# Altium project RadioProject.PrjPcb (part 1 of 2)
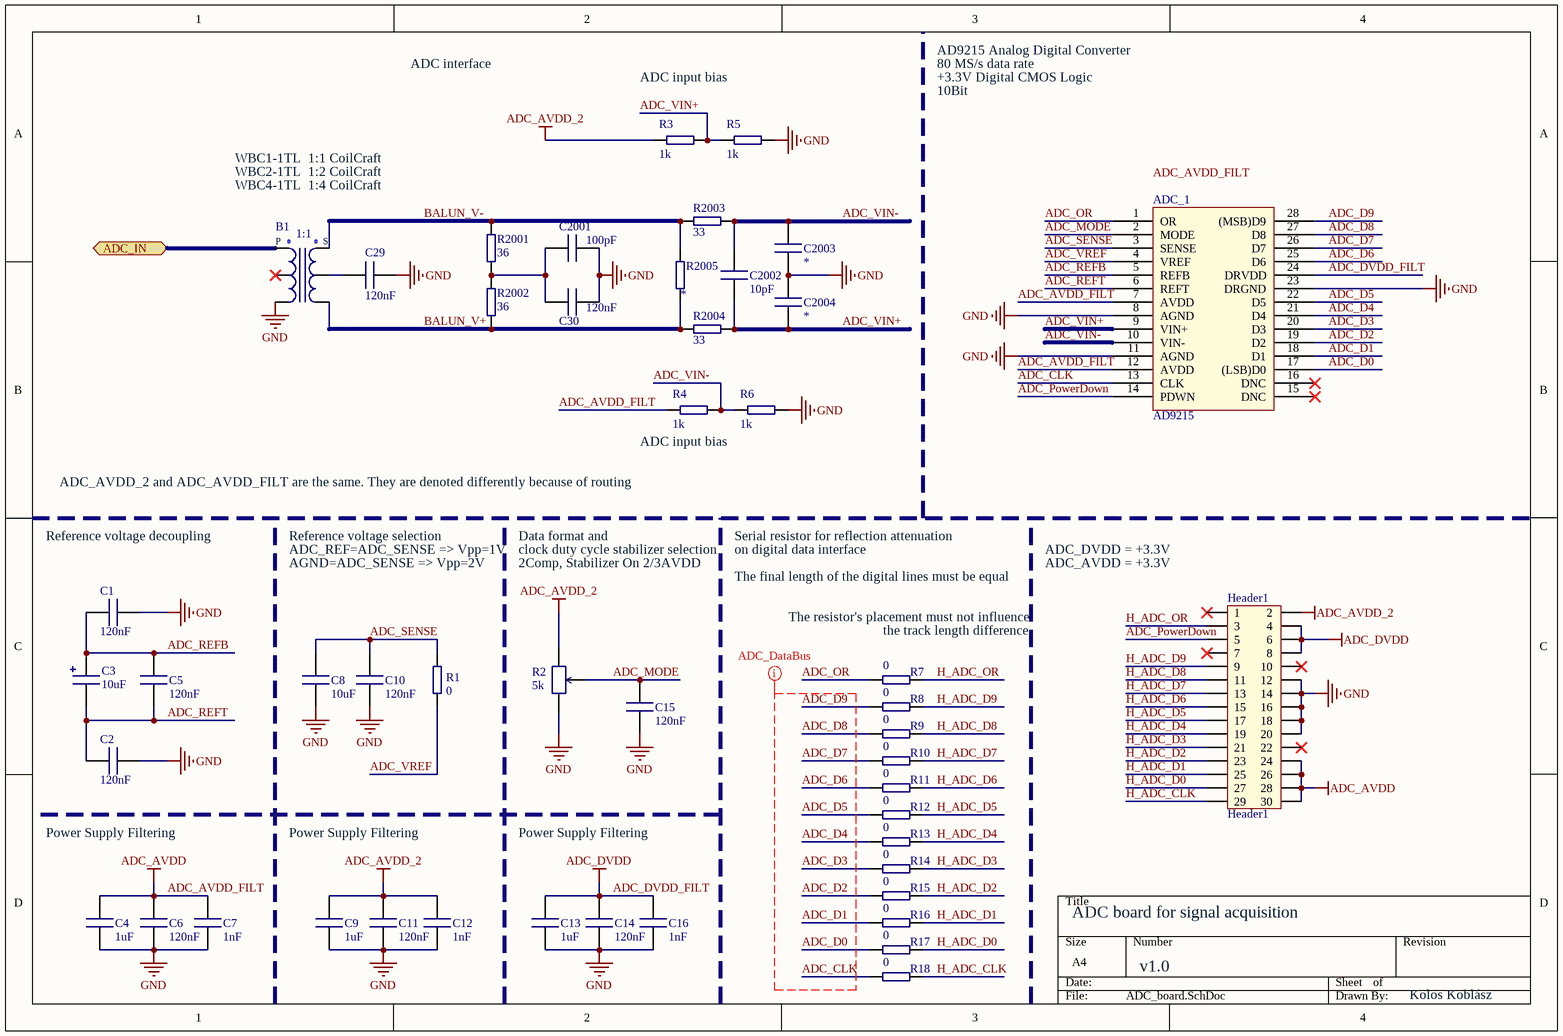
[diagram p0: ADC_board.SchDoc]
9 sheets, 477 parts. Net scope: flat (ports and power ports of the same name join across sheets).
Sheets:
  ADC_board.SchDoc
  DAC_board.SchDoc
  MotherBoard_Interconnect.SchDoc
  ADC_Filter.SchDoc
  DAC_Filter.SchDoc
  MotherBoard_PowerSupply.SchDoc
  Synthesizer.SchDoc
  UpConverter.SchDoc
  DownConverter.SchDoc

## Sheet ADC_board.SchDoc
size A4; DocumentNumber: 1; SheetNumber: 1; SheetTotal: 9

### Parts
ADC_1  AD9215  [AD9215]
B1  ImpedanceTransformation P : S: 1:1  [Balun_Coil_Craft_WBC]  (hidden comment: Balun)
C1  value 120nF  [0805 SMD Passive]  (hidden comment: Cap1)
C2  value 120nF  [0805 SMD Passive]  (hidden comment: Cap1)
C3  value 10uF  [ELKO_CAP]  (hidden comment: Cap2)
C4  value 1uF  [0805 SMD Passive]  (hidden comment: Cap1)
C5  value 120nF  [0805 SMD Passive]  (hidden comment: Cap1)
C6  value 120nF  [0805 SMD Passive]  (hidden comment: Cap1)
C7  value 1nF  [0805 SMD Passive]  (hidden comment: Cap1)
C8  value 10uF  [0805 SMD Passive]  (hidden comment: Cap1)
C9  value 1uF  [0805 SMD Passive]  (hidden comment: Cap1)
C10  value 120nF  [0805 SMD Passive]  (hidden comment: Cap1)
C11  value 120nF  [0805 SMD Passive]  (hidden comment: Cap1)
C12  value 1nF  [0805 SMD Passive]  (hidden comment: Cap1)
C13  value 1uF  [0805 SMD Passive]  (hidden comment: Cap1)
C14  value 120nF  [0805 SMD Passive]  (hidden comment: Cap1)
C15  value 120nF  [0805 SMD Passive]  (hidden comment: Cap1)
C16  value 1nF  [0805 SMD Passive]  (hidden comment: Cap1)
C29  value 120nF  [0805 SMD Passive]  (hidden comment: Cap1)
C30  value 120nF  [0805 SMD Passive]  (hidden comment: Cap1)
C2001  value 100pF  [0805 SMD Passive]  (hidden comment: Cap1)
C2002  value 10pF  [0805 SMD Passive]  (hidden comment: Cap1)
C2003  Cap1  [0805 SMD Passive]  (value not drawn)
C2004  Cap1  [0805 SMD Passive]  (value not drawn)
Header1  Header1  [Header1]
R1  value 0  [0805 SMD Passive]  (hidden comment: Resistor)
R2  value 5k  [TC33-2]  (hidden comment: VariableResistor)
R3  value 1k  [0805 SMD Passive]  (hidden comment: Resistor)
R4  value 1k  [0805 SMD Passive]  (hidden comment: Resistor)
R5  value 1k  [0805 SMD Passive]  (hidden comment: Resistor)
R6  value 1k  [0805 SMD Passive]  (hidden comment: Resistor)
R7  value 0  [0805 SMD Passive]  (hidden comment: Resistor)
R8  value 0  [0805 SMD Passive]  (hidden comment: Resistor)
R9  value 0  [0805 SMD Passive]  (hidden comment: Resistor)
R10  value 0  [0805 SMD Passive]  (hidden comment: Resistor)
R11  value 0  [0805 SMD Passive]  (hidden comment: Resistor)
R12  value 0  [0805 SMD Passive]  (hidden comment: Resistor)
R13  value 0  [0805 SMD Passive]  (hidden comment: Resistor)
R14  value 0  [0805 SMD Passive]  (hidden comment: Resistor)
R15  value 0  [0805 SMD Passive]  (hidden comment: Resistor)
R16  value 0  [0805 SMD Passive]  (hidden comment: Resistor)
R17  value 0  [0805 SMD Passive]  (hidden comment: Resistor)
R18  value 0  [0805 SMD Passive]  (hidden comment: Resistor)
R2001  value 36  [0805 SMD Passive]  (hidden comment: Resistor)
R2002  value 36  [0805 SMD Passive]  (hidden comment: Resistor)
R2003  value 33  [0805 SMD Passive]  (hidden comment: Resistor)
R2004  value 33  [0805 SMD Passive]  (hidden comment: Resistor)
R2005  Resistor  [0805 SMD Passive]  (value not drawn)

### Ports
ADC_IN

### Nets
ADC_AVDD_2: C9.1 C11.1 C12.1 Header1.2 R2.1 R3.1
ADC_AVDD_FILT: ADC_1.7(AVDD) ADC_1.12(AVDD) C4.1 C6.1 C7.1 Header1.24 Header1.26 Header1.28 Header1.30 R4.1  [also labelled ADC_AVDD]
ADC_DVDD_FILT: ADC_1.24(DRVDD) C13.1 C14.1 C16.1 Header1.4 Header1.6 Header1.8  [also labelled ADC_DVDD]
GND: ADC_1.8(AGND) ADC_1.11(AGND) ADC_1.23(DRGND) B1.4 C1.1 C2.2 C4.2 C6.2 C7.2 C8.2 C9.2 C10.2 C11.2 C12.2 C13.2 C14.2 C15.2 C16.2 C29.1 C30.1 C2001.1 C2003.2 C2004.1 Header1.12 Header1.14 Header1.16 Header1.18 Header1.20 R2.2 R5.2 R6.2
ADC_CLK: ADC_1.13(CLK) R18.1
ADC_D0: ADC_1.17((LSB)D0) R17.1
ADC_D1: ADC_1.18(D1) R16.1
ADC_D2: ADC_1.19(D2) R15.1
ADC_D3: ADC_1.20(D3) R14.1
ADC_D4: ADC_1.21(D4) R13.1
ADC_D5: ADC_1.22(D5) R12.1
ADC_D6: ADC_1.25(D6) R11.1
ADC_D7: ADC_1.26(D7) R10.1
ADC_D8: ADC_1.27(D8) R9.1
ADC_D9: ADC_1.28((MSB)D9) R8.1
ADC_MODE: ADC_1.2(MODE) C15.1 R2.3
ADC_OR: ADC_1.1(OR) R7.1
ADC_PowerDown: ADC_1.14(PDWN) Header1.5
ADC_REFB: ADC_1.5(REFB) C1.2 C3.1 C5.1
ADC_REFT: ADC_1.6(REFT) C2.1 C3.2 C5.2
ADC_SENSE: ADC_1.3(SENSE) C8.1 C10.1 R1.2
ADC_VIN+: ADC_1.9(VIN+) C2002.2 C2004.2 R3.2 R5.1 R2004.2
ADC_VIN-: ADC_1.10(VIN-) C2002.1 C2003.1 R4.2 R6.1 R2003.2
ADC_VREF: ADC_1.4(VREF) R1.1
BALUN_V+: B1.3 R2002.1 R2004.1 R2005.1
BALUN_V-: B1.1 R2001.2 R2003.1 R2005.2
Filter_Output: B1.6 ; port ADC_IN
H_ADC_CLK: Header1.29 R18.2
H_ADC_D0: Header1.27 R17.2
H_ADC_D1: Header1.25 R16.2
H_ADC_D2: Header1.23 R15.2
H_ADC_D3: Header1.21 R14.2
H_ADC_D4: Header1.19 R13.2
H_ADC_D5: Header1.17 R12.2
H_ADC_D6: Header1.15 R11.2
H_ADC_D7: Header1.13 R10.2
H_ADC_D8: Header1.11 R9.2
H_ADC_D9: Header1.9 R8.2
H_ADC_OR: Header1.3 R7.2
NetB1_2: B1.2 C29.2
NetC30_2: C30.2 C2001.2 R2001.1 R2002.2

Not connected (* = marked no-connect by the designer): ADC_1 15(DNC)* 16(DNC)*; B1 5*; Header1 1* 7* 10* 22*

### Layout directives
net class ADC_DataBus: ADC_CLK, ADC_D0, ADC_D1, ADC_D2, ADC_D3, ADC_D4, ADC_D5, ADC_D6, ADC_D7, ADC_D8, ADC_D9

### Notes on the sheet
- ADC interface
- ADC input bias
- AD9215 Analog Digital Converter
- 80 MS/s data rate
- +3.3V Digital CMOS Logic
- 10Bit
- WBC1-1TL  1:1 CoilCraft
- WBC2-1TL  1:2 CoilCraft
- WBC4-1TL  1:4 CoilCraft
- ADC_AVDD_2 and ADC_AVDD_FILT are the same. They are denoted differently because of routing
- Reference voltage decoupling
- Reference voltage selection
- ADC_REF=ADC_SENSE => Vpp=1V
- AGND=ADC_SENSE => Vpp=2V
- Data format and
- clock duty cycle stabilizer selection
- 2Comp, Stabilizer On 2/3AVDD
- Serial resistor for reflection attenuation
- on digital data interface
- The final length of the digital lines must be equal
- ADC_DVDD = +3.3V
- ADC_AVDD = +3.3V
- The resistor's placement must not influence
- (near R7) the track length difference
- Power Supply Filtering
- ADC board for signal acquisition
- v1.0
- Kolos Koblász
- Labels drawn without touching a wire or pin: ADC_AVDD_FILT
- (in symbol Balun3) P; S

### Library data of the parts
ADC_1 = AD9215: Analog Digital Converter; Manufacturer: Analog Devices; OrderCode: AD9215BRUZ-80; PartNumber: AD9215; FootPrint: RU-28
B1 = Balun3: SMD Balun; Manufacturer: CoilCraft; PartNumber: WBC1-1TL; MaxFrequency: 700MHz; MinFrequency: 0.25MHz; FootPrint: SMD
C1 C2 C4-C16 C29 C30 C2001-C2004 = Cap1: SMD Capacitor; Precision: 1%; MaxVolt: 16V; FootPrint: *
  C2003 C2004: Value: *
C3 = Cap2: SMD Polarized Capacitor; Precision: 1%; MaxVolt: 16V; FootPrint: *
Header1 = Header1: 29 Pin Header; PartNumber: TLW-115-01-G-D-002-RA; Manufacterer: Samtec; PinNumber: 29; Row: 2; Pitch: 2.54mm; Type: 90°
R1 R3-R18 R2001-R2005 = Res1: SMD Resistor; Precision: 1%; MaxPower: 0.1W; FootPrint: SMD
  R2005: Value: *
R2 = VarRes1: SMD Variable Resistor; Precision: 1%; MaxPower: 0.1W; FootPrint: SMD; Manufacturer ID: *

## Sheet DAC_board.SchDoc
size A4; DocumentNumber: 2; SheetNumber: 2; SheetTotal: 9
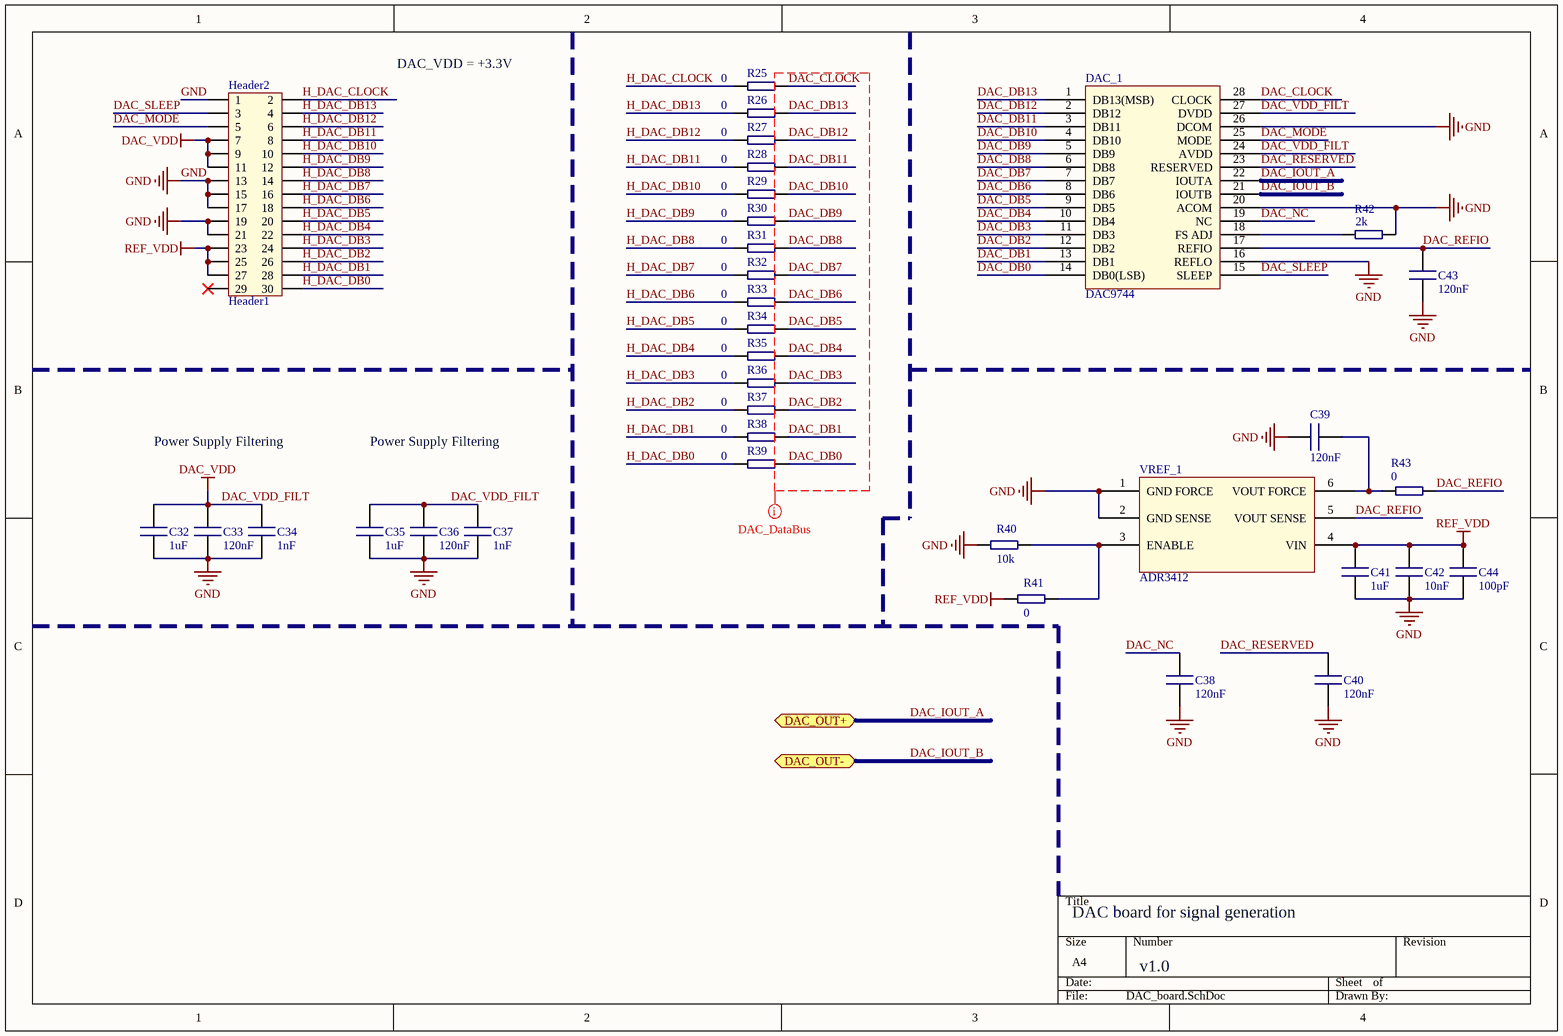
[diagram p1: DAC_board.SchDoc]

### Parts
C32  value 1uF  [0805 SMD Passive]  (hidden comment: Cap1)
C33  value 120nF  [0805 SMD Passive]  (hidden comment: Cap1)
C34  value 1nF  [0805 SMD Passive]  (hidden comment: Cap1)
C35  value 1uF  [0805 SMD Passive]  (hidden comment: Cap1)
C36  value 120nF  [0805 SMD Passive]  (hidden comment: Cap1)
C37  value 1nF  [0805 SMD Passive]  (hidden comment: Cap1)
C38  value 120nF  [0805 SMD Passive]  (hidden comment: Cap1)
C39  value 120nF  [0805 SMD Passive]  (hidden comment: Cap1)
C40  value 120nF  [0805 SMD Passive]  (hidden comment: Cap1)
C41  value 1uF  [0805 SMD Passive]  (hidden comment: Cap1)
C42  value 10nF  [0805 SMD Passive]  (hidden comment: Cap1)
C43  value 120nF  [0805 SMD Passive]  (hidden comment: Cap1)
C44  value 100pF  [0805 SMD Passive]  (hidden comment: Cap1)
DAC_1  DAC9744  [AD9744]
Header2  Header1  [Header1]
R25  value 0  [0805 SMD Passive]  (hidden comment: Resistor)
R26  value 0  [0805 SMD Passive]  (hidden comment: Resistor)
R27  value 0  [0805 SMD Passive]  (hidden comment: Resistor)
R28  value 0  [0805 SMD Passive]  (hidden comment: Resistor)
R29  value 0  [0805 SMD Passive]  (hidden comment: Resistor)
R30  value 0  [0805 SMD Passive]  (hidden comment: Resistor)
R31  value 0  [0805 SMD Passive]  (hidden comment: Resistor)
R32  value 0  [0805 SMD Passive]  (hidden comment: Resistor)
R33  value 0  [0805 SMD Passive]  (hidden comment: Resistor)
R34  value 0  [0805 SMD Passive]  (hidden comment: Resistor)
R35  value 0  [0805 SMD Passive]  (hidden comment: Resistor)
R36  value 0  [0805 SMD Passive]  (hidden comment: Resistor)
R37  value 0  [0805 SMD Passive]  (hidden comment: Resistor)
R38  value 0  [0805 SMD Passive]  (hidden comment: Resistor)
R39  value 0  [0805 SMD Passive]  (hidden comment: Resistor)
R40  value 10k  [0805 SMD Passive]  (hidden comment: Resistor)
R41  value 0  [0805 SMD Passive]  (hidden comment: Resistor)
R42  value 2k  [0805 SMD Passive]  (hidden comment: Resistor)
R43  value 0  [0805 SMD Passive]  (hidden comment: Resistor)
VREF_1  ADR3412  [ADR3412]

### Ports
DAC_OUT+, DAC_OUT-

### Nets
DAC_VDD_FILT: C32.1 C33.1 C34.1 C35.1 C36.1 C37.1 DAC_1.24(AVDD) DAC_1.27(DVDD) Header2.7 Header2.9 Header2.11  [also labelled DAC_VDD]
GND: C32.2 C33.2 C34.2 C35.2 C36.2 C37.2 C38.2 C39.2 C40.2 C41.2 C42.2 C43.2 C44.2 DAC_1.16(REFLO) DAC_1.20(ACOM) DAC_1.26(DCOM) Header2.1 Header2.13 Header2.15 Header2.17 Header2.19 Header2.21 R40.2 R42.2 VREF_1.1(GND_FORCE) VREF_1.2(GND_SENSE)
REF_VDD: C41.1 C42.1 C44.1 Header2.23 Header2.25 Header2.27 R41.2 VREF_1.4(VIN)
DAC_CLOCK: DAC_1.28(CLOCK) R25.2
DAC_DB0: DAC_1.14(DB0(LSB)) R39.2
DAC_DB1: DAC_1.13(DB1) R38.2
DAC_DB2: DAC_1.12(DB2) R37.2
DAC_DB3: DAC_1.11(DB3) R36.2
DAC_DB4: DAC_1.10(DB4) R35.2
DAC_DB5: DAC_1.9(DB5) R34.2
DAC_DB6: DAC_1.8(DB6) R33.2
DAC_DB7: DAC_1.7(DB7) R32.2
DAC_DB8: DAC_1.6(DB8) R31.2
DAC_DB9: DAC_1.5(DB9) R30.2
DAC_DB10: DAC_1.4(DB10) R29.2
DAC_DB11: DAC_1.3(DB11) R28.2
DAC_DB12: DAC_1.2(DB12) R27.2
DAC_DB13: DAC_1.1(DB13(MSB)) R26.2
DAC_IOUT_A: DAC_1.22(IOUTA) ; port DAC_OUT+
DAC_IOUT_B: DAC_1.21(IOUTB) ; port DAC_OUT-
DAC_MODE: DAC_1.25(MODE) Header2.5
DAC_NC: C38.1 DAC_1.19(NC)
DAC_REFIO: C43.1 DAC_1.17(REFIO) R43.2 VREF_1.5(VOUT_SENSE)
DAC_RESERVED: C40.1 DAC_1.23(RESERVED)
DAC_SLEEP: DAC_1.15(SLEEP) Header2.3
H_DAC_CLOCK: Header2.2 R25.1
H_DAC_DB0: Header2.30 R39.1
H_DAC_DB1: Header2.28 R38.1
H_DAC_DB2: Header2.26 R37.1
H_DAC_DB3: Header2.24 R36.1
H_DAC_DB4: Header2.22 R35.1
H_DAC_DB5: Header2.20 R34.1
H_DAC_DB6: Header2.18 R33.1
H_DAC_DB7: Header2.16 R32.1
H_DAC_DB8: Header2.14 R31.1
H_DAC_DB9: Header2.12 R30.1
H_DAC_DB10: Header2.10 R29.1
H_DAC_DB11: Header2.8 R28.1
H_DAC_DB12: Header2.6 R27.1
H_DAC_DB13: Header2.4 R26.1
NetC39_1: C39.1 R43.1 VREF_1.6(VOUT_FORCE)
NetDAC_1_18: DAC_1.18(FS_ADJ) R42.1
NetR40_1: R40.1 R41.1 VREF_1.3(ENABLE)

Not connected (* = marked no-connect by the designer): Header2 29*

### Layout directives
net class DAC_DataBus: DAC_CLOCK, DAC_DB0, DAC_DB1, DAC_DB2, DAC_DB3, DAC_DB4, DAC_DB5, DAC_DB6, DAC_DB7, DAC_DB8, DAC_DB9, DAC_DB10, DAC_DB11, DAC_DB12, DAC_DB13

### Notes on the sheet
- DAC_VDD = +3.3V
- Power Supply Filtering
- DAC board for signal generation
- v1.0

### Library data of the parts
C32-C44 = Cap1: as C1 on sheet ADC_board; FootPrint: *
DAC_1 = AD9744: Digital Analog Converter; Manufacturer: Analog Devices; Order Code: AD9744ARZ; Package Description: 28-Lead TSSOP; PartNumber: AD9744
Header2 = Header1: as Header1 on sheet ADC_board; Type: 90°
R25-R43 = Res1: as R1 on sheet ADC_board; FootPrint: SMD
VREF_1 = ADR3412: 1.2 Voltage Ref Source; Manufacturer: Analog Devices; Order Code: ADR3412ARJZ-R2; Package Description: 6-Lead SOT-23; PartNumber: ADR3412

## Sheet MotherBoard_Interconnect.SchDoc
size A4; DocumentNumber: 3; SheetNumber: 3; SheetTotal: 9
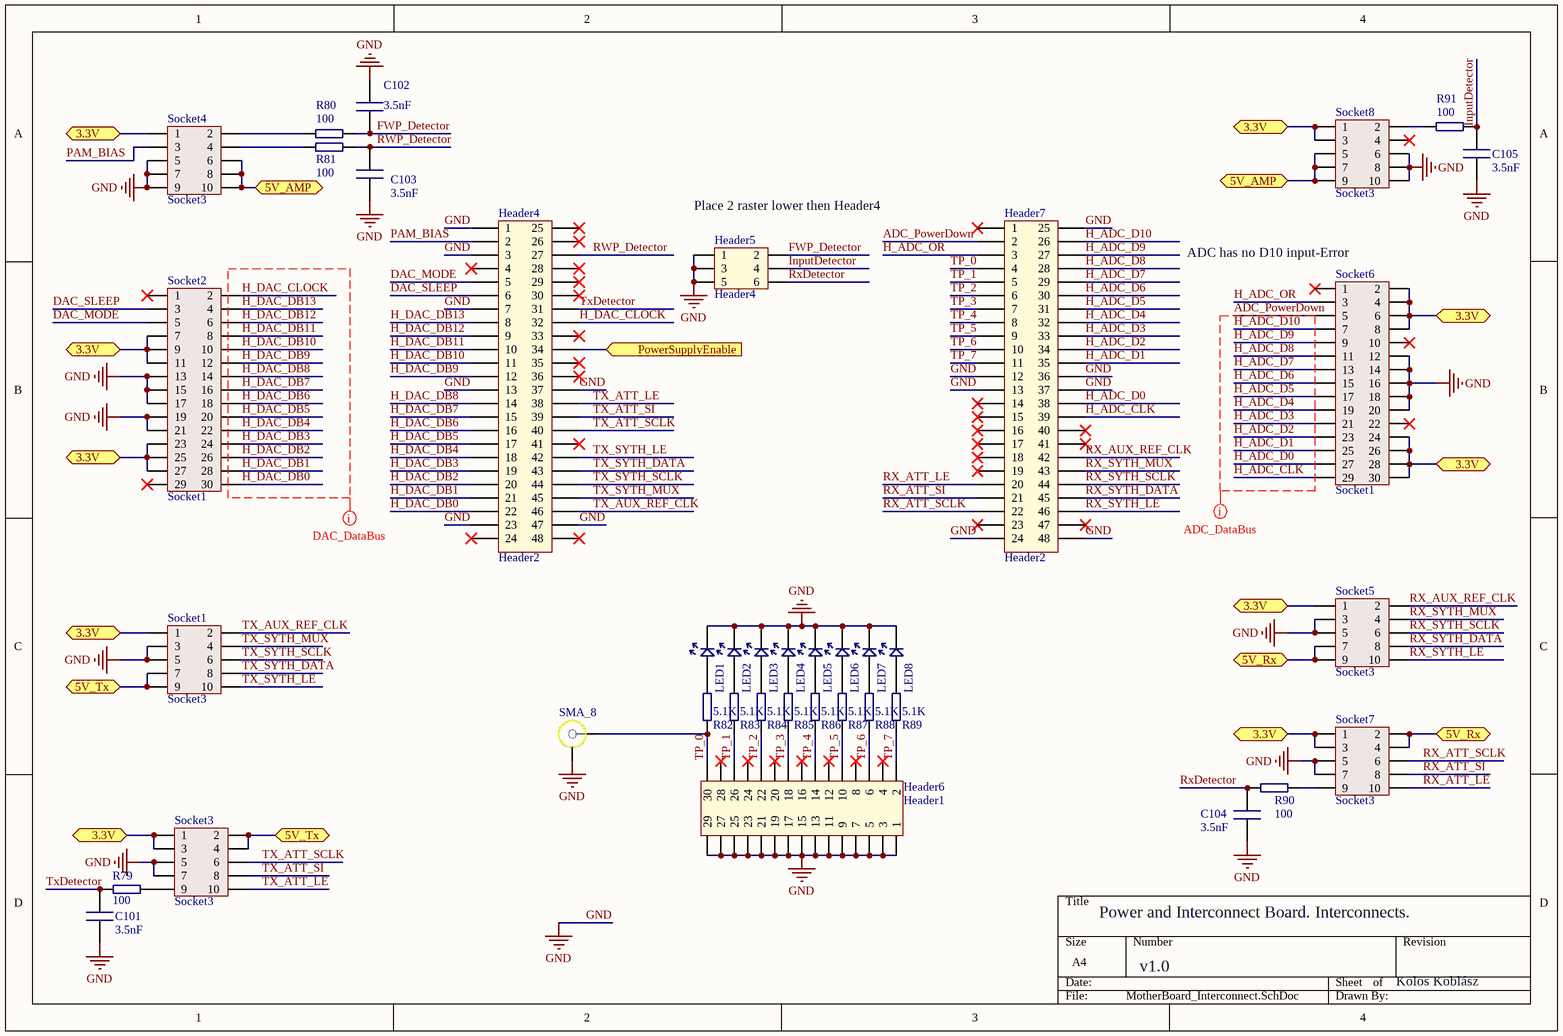
[diagram p2: MotherBoard_Interconnect.SchDoc]

### Parts
C101  value 3.5nF  [0805 SMD Passive]  (hidden comment: Cap1)
C102  value 3.5nF  [0805 SMD Passive]  (hidden comment: Cap1)
C103  value 3.5nF  [0805 SMD Passive]  (hidden comment: Cap1)
C104  value 3.5nF  [0805 SMD Passive]  (hidden comment: Cap1)
C105  value 3.5nF  [0805 SMD Passive]  (hidden comment: Cap1)
Header4  Header2  [Header2]
Header5  Header4  [Header4]
Header6  Header1  [Header1]
Header7  Header2  [Header2]
LED1  TP0  [0805 SMD Passive]  (value not drawn)
LED2  TP1  [0805 SMD Passive]  (value not drawn)
LED3  TP2  [0805 SMD Passive]  (value not drawn)
LED4  TP3  [0805 SMD Passive]  (value not drawn)
LED5  TP4  [0805 SMD Passive]  (value not drawn)
LED6  TP5  [0805 SMD Passive]  (value not drawn)
LED7  TP6  [0805 SMD Passive]  (value not drawn)
LED8  TP7  [0805 SMD Passive]  (value not drawn)
R79  value 100  [0805 SMD Passive]  (hidden comment: Resistor)
R80  value 100  [0805 SMD Passive]  (hidden comment: Resistor)
R81  value 100  [0805 SMD Passive]  (hidden comment: Resistor)
R82  value 5.1K  [0805 SMD Passive]  (hidden comment: Resistor)
R83  value 5.1K  [0805 SMD Passive]  (hidden comment: Resistor)
R84  value 5.1K  [0805 SMD Passive]  (hidden comment: Resistor)
R85  value 5.1K  [0805 SMD Passive]  (hidden comment: Resistor)
R86  value 5.1K  [0805 SMD Passive]  (hidden comment: Resistor)
R87  value 5.1K  [0805 SMD Passive]  (hidden comment: Resistor)
R88  value 5.1K  [0805 SMD Passive]  (hidden comment: Resistor)
R89  value 5.1K  [0805 SMD Passive]  (hidden comment: Resistor)
R90  value 100  [0805 SMD Passive]  (hidden comment: Resistor)
R91  value 100  [0805 SMD Passive]  (hidden comment: Resistor)
SMA_8  SMA_2  [SMA_Board]  (value not drawn)
Socket1  Socket3  [Socket3]
Socket2  Socket1  [Socket1]
Socket3  Socket3  [Socket3]
Socket4  Socket3  [Socket3]
Socket5  Socket3  [Socket3]
Socket6  Socket1  [Socket1]
Socket7  Socket3  [Socket3]
Socket8  Socket3  [Socket3]

### Ports
3.3V, 5V_AMP, 5V_Rx, 5V_Tx, PowerSupplyEnable

### Nets
GND: C101.2 C102.2 C103.2 C104.2 C105.2 Header4.1 Header4.3 Header4.7 Header4.13 Header4.23 Header4.37 Header4.47 Header5.1 Header5.3 Header5.5 Header6.1 Header6.3 Header6.5 Header6.7 Header6.9 Header6.11 Header6.13 Header6.15 Header6.17 Header6.19 Header6.21 Header6.23 Header6.25 Header6.27 Header6.29 Header7.12 Header7.13 Header7.24 Header7.25 Header7.36 Header7.37 Header7.48 LED1.1(K) LED2.1(K) LED3.1(K) LED4.1(K) LED5.1(K) LED6.1(K) LED7.1(K) LED8.1(K) SMA_8.2 Socket1.3 Socket1.5 Socket2.13 Socket2.15 Socket2.17 Socket2.19 Socket2.21 Socket3.5 Socket3.7 Socket4.5 Socket4.7 Socket4.9 Socket5.3 Socket5.5 Socket6.12 Socket6.14 Socket6.16 Socket6.18 Socket6.20 Socket7.5 Socket7.7 Socket8.6 Socket8.8 Socket8.10
3.3V: Socket1.1 Socket2.7 Socket2.9 Socket2.11 Socket2.23 Socket2.25 Socket2.27 Socket3.1 Socket3.3 Socket4.1 Socket5.1 Socket6.2 Socket6.4 Socket6.6 Socket6.8 Socket6.24 Socket6.26 Socket6.28 Socket6.30 Socket7.1 Socket7.3 Socket8.1 Socket8.3 ; port 3.3V
5V_Amp: Socket4.6 Socket4.8 Socket4.10 Socket8.5 Socket8.7 Socket8.9 ; port 5V_AMP
5V_Rx: Socket5.7 Socket5.9 Socket7.2 Socket7.4 ; port 5V_Rx
5V_Tx: Socket1.7 Socket1.9 Socket3.2 Socket3.4 ; port 5V_Tx
ADC_PowerDown: Header7.2 Socket6.5
DAC_MODE: Header4.5 Socket2.5
DAC_SLEEP: Header4.6 Socket2.3
FWP_Detector: C102.1 Header5.2 R80.2
H_ADC_CLK: Header7.39 Socket6.29
H_ADC_D0: Header7.38 Socket6.27
H_ADC_D1: Header7.35 Socket6.25
H_ADC_D2: Header7.34 Socket6.23
H_ADC_D3: Header7.33 Socket6.21
H_ADC_D4: Header7.32 Socket6.19
H_ADC_D5: Header7.31 Socket6.17
H_ADC_D6: Header7.30 Socket6.15
H_ADC_D7: Header7.29 Socket6.13
H_ADC_D8: Header7.28 Socket6.11
H_ADC_D9: Header7.27 Socket6.9
H_ADC_D10: Header7.26 Socket6.7
H_ADC_OR: Header7.3 Socket6.3
H_DAC_CLOCK: Header4.32 Socket2.2
H_DAC_DB0: Header4.22 Socket2.30
H_DAC_DB1: Header4.21 Socket2.28
H_DAC_DB2: Header4.20 Socket2.26
H_DAC_DB3: Header4.19 Socket2.24
H_DAC_DB4: Header4.18 Socket2.22
H_DAC_DB5: Header4.17 Socket2.20
H_DAC_DB6: Header4.16 Socket2.18
H_DAC_DB7: Header4.15 Socket2.16
H_DAC_DB8: Header4.14 Socket2.14
H_DAC_DB9: Header4.12 Socket2.12
H_DAC_DB10: Header4.11 Socket2.10
H_DAC_DB11: Header4.10 Socket2.8
H_DAC_DB12: Header4.9 Socket2.6
H_DAC_DB13: Header4.8 Socket2.4
InputDetector: C105.1 Header5.4 R91.1
PAM_BIAS: Header4.2 Socket4.3
RWP_Detector: C103.1 Header4.27 R81.2
RX_ATT_LE: Header7.20 Socket7.10
RX_ATT_SCLK: Header7.22 Socket7.6
RX_ATT_SI: Header7.21 Socket7.8
RX_AUX_REF_CLK: Header7.42 Socket5.2
RX_SYTH_DATA: Header7.45 Socket5.8
RX_SYTH_LE: Header7.46 Socket5.10
RX_SYTH_MUX: Header7.43 Socket5.4
RX_SYTH_SCLK: Header7.44 Socket5.6
RxDetector: C104.1 Header5.6 R90.1
TP_0: Header6.30 Header7.4 R82.1 SMA_8.1
TP_1: Header6.26 Header7.5 R83.1
TP_2: Header6.22 Header7.6 R84.1
TP_3: Header6.18 Header7.7 R85.1
TP_4: Header6.14 Header7.8 R86.1
TP_5: Header6.10 Header7.9 R87.1
TP_6: Header6.6 Header7.10 R88.1
TP_7: Header6.2 Header7.11 R89.1
TX_ATT_LE: Header4.38 Socket3.10
TX_ATT_SCLK: Header4.40 Socket3.6
TX_ATT_SI: Header4.39 Socket3.8
TX_AUX_REF_CLK: Header4.46 Socket1.2
TX_SYTH_DATA: Header4.43 Socket1.8
TX_SYTH_LE: Header4.42 Socket1.10
TX_SYTH_MUX: Header4.45 Socket1.4
TX_SYTH_SCLK: Header4.44 Socket1.6
TxDetector: C101.1 Header4.31 R79.1
NetHeader4_34: Header4.34 ; port PowerSupplyEnable
NetLED1_2: LED1.2(A) R82.2
NetLED2_2: LED2.2(A) R83.2
NetLED3_2: LED3.2(A) R84.2
NetLED4_2: LED4.2(A) R85.2
NetLED5_2: LED5.2(A) R86.2
NetLED6_2: LED6.2(A) R87.2
NetLED7_2: LED7.2(A) R88.2
NetLED8_2: LED8.2(A) R89.2
NetR79_2: R79.2 Socket3.9
NetR80_1: R80.1 Socket4.2
NetR81_1: R81.1 Socket4.4
NetR90_2: R90.2 Socket7.9
NetR91_2: R91.2 Socket8.2

Not connected (* = marked no-connect by the designer): Header4 4* 24* 25* 26* 28* 29* 30* 33* 35* 36* 41* 48*; Header6 4* 8* 12* 16* 20* 24* 28*; Header7 1* 14* 15* 16* 17* 18* 19* 23* 40* 41* 47*; Socket2 1* 29*; Socket6 1* 10* 22*; Socket8 4*

### Layout directives
net class ADC_DataBus: ADC_PowerDown, H_ADC_CLK, H_ADC_D0, H_ADC_D1, H_ADC_D2, H_ADC_D3, H_ADC_D4, H_ADC_D5, H_ADC_D6, H_ADC_D7, H_ADC_D8, H_ADC_D9, H_ADC_D10
net class DAC_DataBus: H_DAC_CLOCK, H_DAC_DB0, H_DAC_DB1, H_DAC_DB2, H_DAC_DB3, H_DAC_DB4, H_DAC_DB5, H_DAC_DB6, H_DAC_DB7, H_DAC_DB8, H_DAC_DB9, H_DAC_DB10, H_DAC_DB11, H_DAC_DB12, H_DAC_DB13

### Notes on the sheet
- (near Header5) Place 2 raster lower then Header4
- (near Socket6) ADC has no D10 input-Error
- Power and Interconnect Board. Interconnects.
- v1.0
- Kolos Koblász

### Library data of the parts
C101-C105 = Cap1: as C1 on sheet ADC_board; FootPrint: *
Header4 Header7 = Header2: 48 Pin Header; PinNumber: 48; Row: 2; Pitch: 2.54mm; Type: 180°; Digi Key Order Code: 3M156386-48-ND
Header5 = Header4: 6pin DIL header; PinNumber: 6; Row: 2; Pitch: 2.54mm; Type: Straight
Header6 = Header1: as Header1 on sheet ADC_board; Type: 90°
LED1 LED8 = LED_Green: Diode; Manufacturer: LITEON; Partnumber: LTST-C171KGKT; Type: Green; MaxForwardCurrent: 30mA; MaxRevVoltage: 5V; ForwardCurrent: 20mA; ForwardVoltage: 2V; OrderCode: 160-1426-1-ND; Footprint: 0805
LED2-LED7 = LED_Green: Diode; Manufacturer: LITEON; Partnumber: LTST-C171KGKT; Type: Green; OrderCode: 160-1426-1-ND; MaxForwardCurrent: 30mA; MaxRevVoltage: 5V; ForwardCurrent: 20mA; ForwardVoltage: 2V; Footprint: 0805
R79-R91 = Res1: as R1 on sheet ADC_board; FootPrint: SMD
SMA_8 = SMA_2: SMA Female; Shape: Straight; Footprint: *; PartNumber: *; Manufacturer: *; OrderCode: *; Mounting: TroughHole
Socket1 Socket3-Socket5 Socket7 Socket8 = Socket3: 10 Pin Socket; PinNumber: 10; Row: 2; Pitch: 2.54mm; Type: 180°
Socket2 Socket6 = Socket1: 30 Pin Socket; PartNumber: SLW-115-01-G-D; Manufacterer: Samtec; PinNumber: 30; Row: 2; Pitch: 2.54mm; Type: 180°

## Sheet ADC_Filter.SchDoc
size A4; DocumentNumber: 4; SheetNumber: 4; SheetTotal: 9
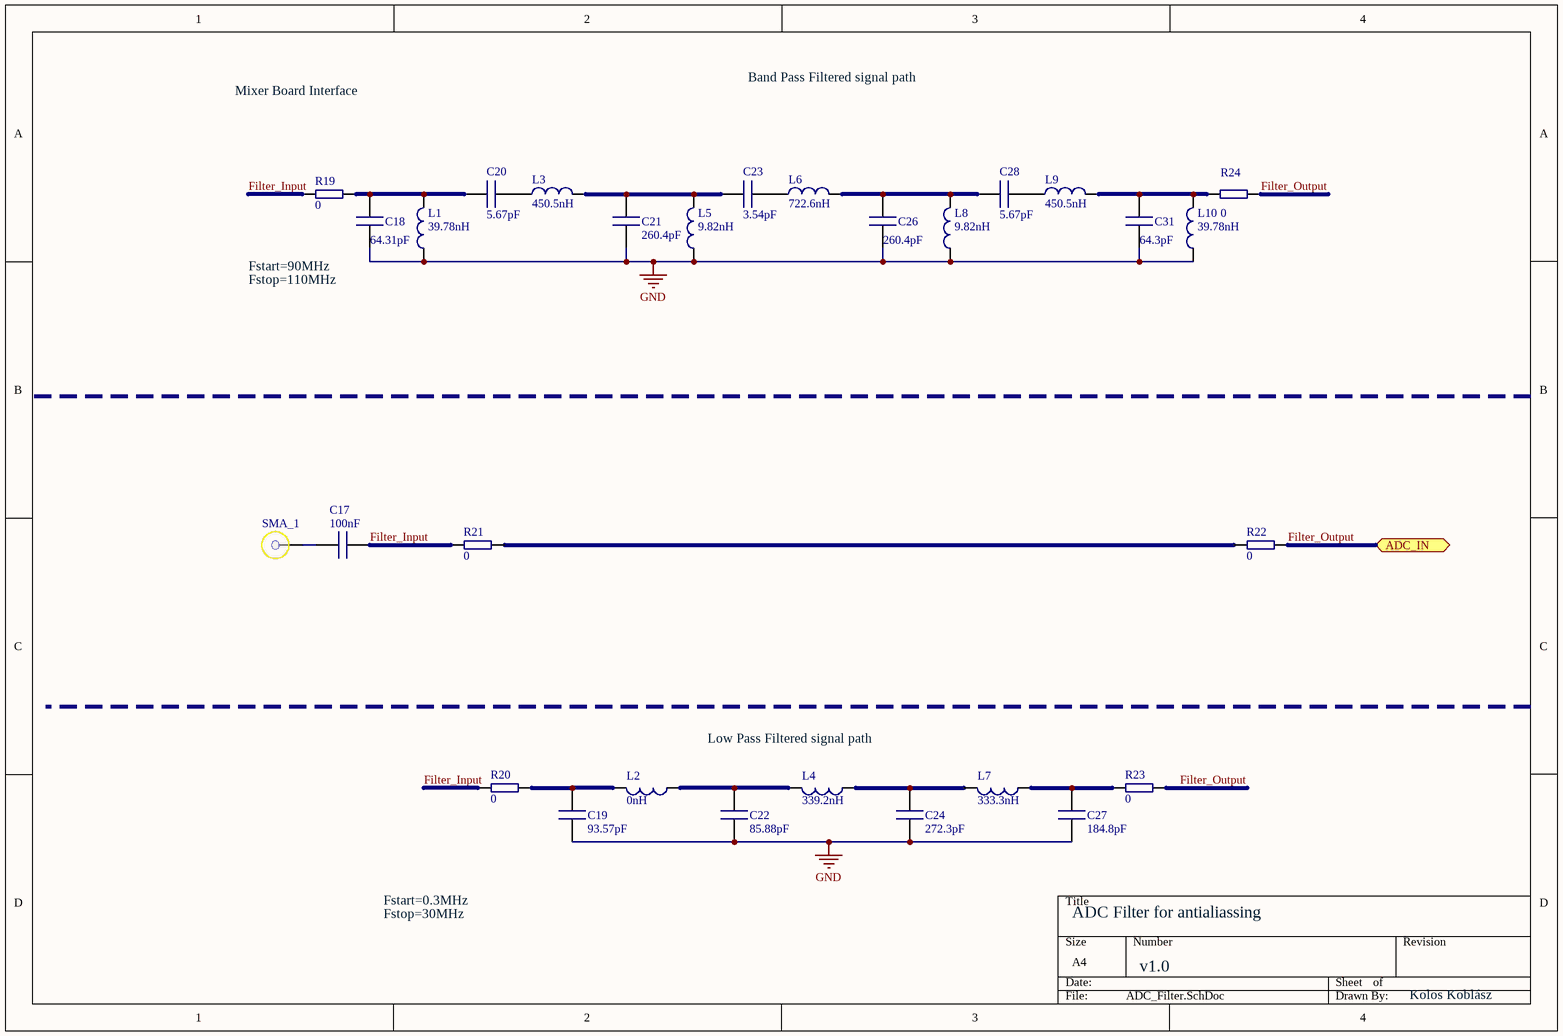
[diagram p3: ADC_Filter.SchDoc]

### Parts
C17  value 100nF  [0805 SMD Passive]  (hidden comment: Cap1)
C18  value 64.31pF  [0805 SMD Passive]  (hidden comment: Cap1)
C19  value 93.57pF  [0805 SMD Passive]  (hidden comment: Cap1)
C20  value 5.67pF  [0805 SMD Passive]  (hidden comment: Cap1)
C21  value 260.4pF  [0805 SMD Passive]  (hidden comment: Cap1)
C22  value 85.88pF  [0805 SMD Passive]  (hidden comment: Cap1)
C23  value 3.54pF  [0805 SMD Passive]  (hidden comment: Cap1)
C24  value 272.3pF  [0805 SMD Passive]  (hidden comment: Cap1)
C26  value 260.4pF  [0805 SMD Passive]  (hidden comment: Cap1)
C27  value 184.8pF  [0805 SMD Passive]  (hidden comment: Cap1)
C28  value 5.67pF  [0805 SMD Passive]  (hidden comment: Cap1)
C31  value 64.3pF  [0805 SMD Passive]  (hidden comment: Cap1)
L1  value 39.78nH  [0805 SMD Passive]  (hidden comment: Inductor)
L2  value 0nH  [0805 SMD Passive]  (hidden comment: Inductor)
L3  value 450.5nH  [0805 SMD Passive]  (hidden comment: Inductor)
L4  value 339.2nH  [0805 SMD Passive]  (hidden comment: Inductor)
L5  value 9.82nH  [0805 SMD Passive]  (hidden comment: Inductor)
L6  value 722.6nH  [0805 SMD Passive]  (hidden comment: Inductor)
L7  value 333.3nH  [0805 SMD Passive]  (hidden comment: Inductor)
L8  value 9.82nH  [0805 SMD Passive]  (hidden comment: Inductor)
L9  value 450.5nH  [0805 SMD Passive]  (hidden comment: Inductor)
L10  value 39.78nH  [0805 SMD Passive]  (hidden comment: Inductor)
R19  value 0  [0805 SMD Passive]  (hidden comment: Resistor)
R20  value 0  [0805 SMD Passive]  (hidden comment: Resistor)
R21  value 0  [0805 SMD Passive]  (hidden comment: Resistor)
R22  value 0  [0805 SMD Passive]  (hidden comment: Resistor)
R23  value 0  [0805 SMD Passive]  (hidden comment: Resistor)
R24  value 0  [0805 SMD Passive]  (hidden comment: Resistor)
SMA_1  SMA1  [SMA Flange]  (value not drawn)

### Ports
ADC_IN

### Nets
GND: C18.2 C19.1 C21.2 C22.1 C24.1 C26.2 C27.1 C31.2 L1.1 L5.1 L8.1 L10.1
Filter_Input: C17.1 R19.2 R20.2 R21.2
Filter_Output: R22.1 R23.1 R24.1 ; port ADC_IN
NetC17_2: C17.2 SMA_1.1
NetC18_1: C18.1 C20.1 L1.2 R19.1
NetC19_2: C19.2 L2.2 R20.1
NetC20_2: C20.2 L3.1
NetC21_1: C21.1 C23.1 L3.2 L5.2
NetC22_2: C22.2 L2.1 L4.2
NetC23_2: C23.2 L6.1
NetC24_2: C24.2 L4.1 L7.2
NetC26_1: C26.1 C28.1 L6.2 L8.2
NetC27_2: C27.2 L7.1 R23.2
NetC28_2: C28.2 L9.1
NetC31_1: C31.1 L9.2 L10.2 R24.2
NetR21_1: R21.1 R22.2

### Notes on the sheet
- Mixer Board Interface
- Band Pass Filtered signal path
- Fstart=90MHz
- Fstop=110MHz
- Low Pass Filtered signal path
- Fstart=0.3MHz
- Fstop=30MHz
- ADC Filter for antialiassing
- v1.0
- Kolos Koblász

### Library data of the parts
C17-C24 C26-C28 C31 = Cap1: as C1 on sheet ADC_board; FootPrint: *
L1-L10 = Ind1: SMD Inductor; Precision: 10%; MaxCurent: 100mA; FootPrint: SMD
R19-R24 = Res1: as R1 on sheet ADC_board; FootPrint: SMD
SMA_1 = SMA1: SMA Female; Shape: Straight; Footprint: *; PartNumber: *; Manufacturer: *; OrderCode: *; Mounting: TroughHole

## Sheet DAC_Filter.SchDoc
size A4; DocumentNumber: 5; SheetNumber: 5; SheetTotal: 9
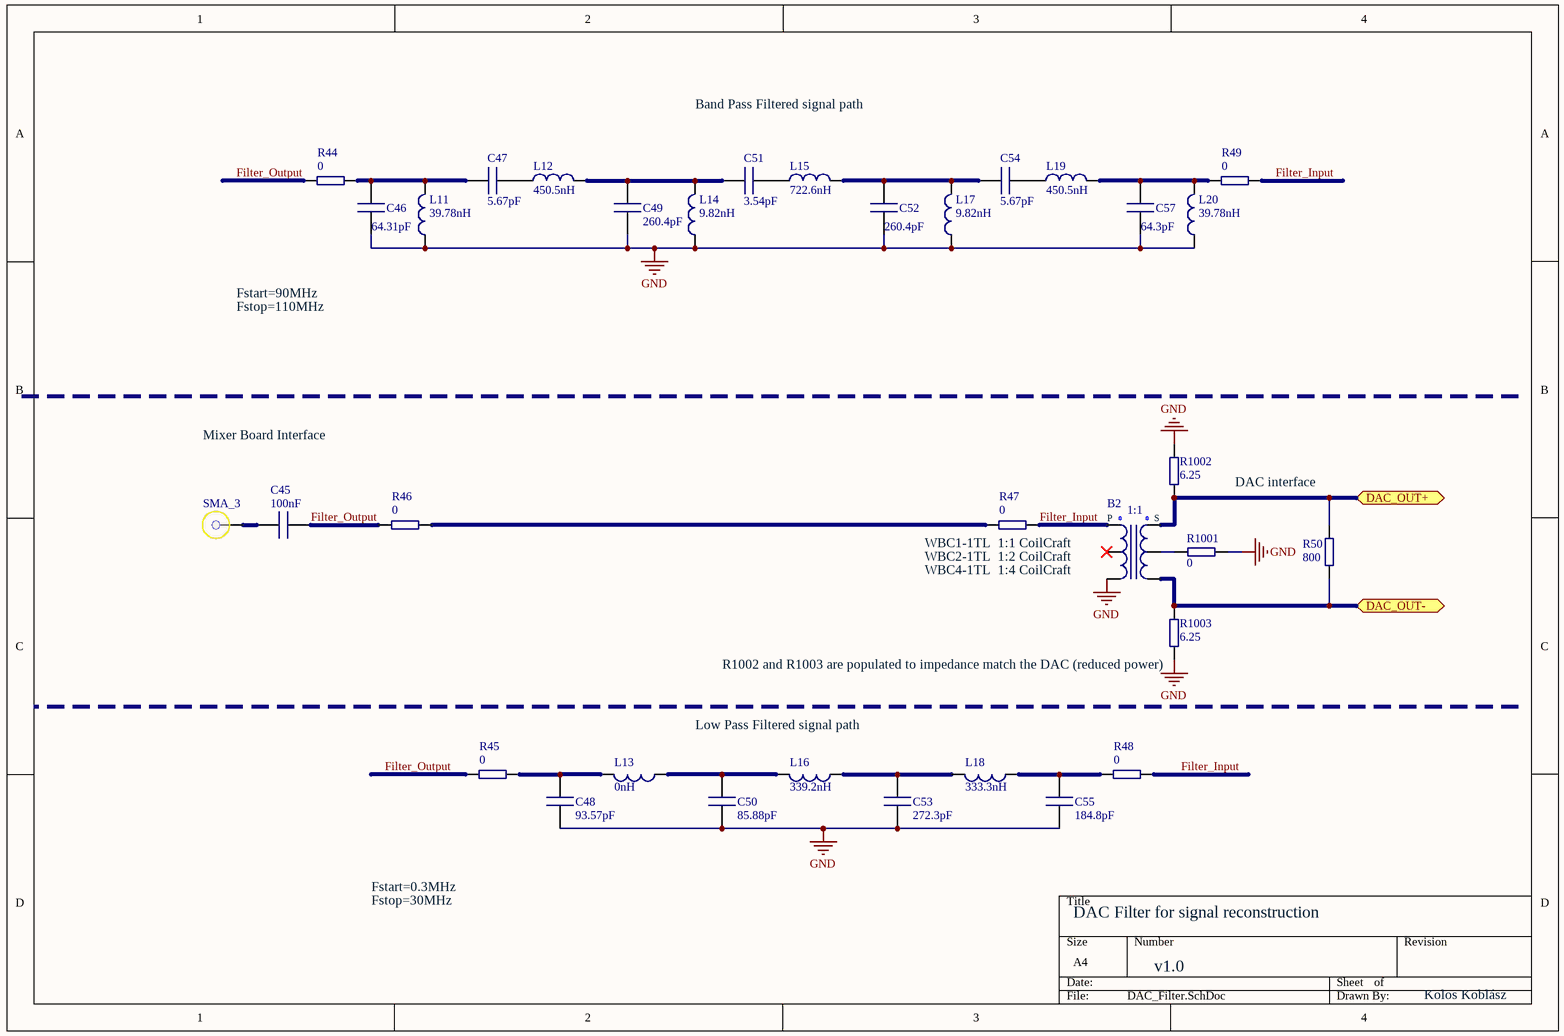
[diagram p4: DAC_Filter.SchDoc]

### Parts
B2  ImpedanceTransformation P : S: 1:1  [Balun_Coil_Craft_WBC]  (hidden comment: Balun)
C45  value 100nF  [0805 SMD Passive]  (hidden comment: Cap1)
C46  value 64.31pF  [0805 SMD Passive]  (hidden comment: Cap1)
C47  value 5.67pF  [0805 SMD Passive]  (hidden comment: Cap1)
C48  value 93.57pF  [0805 SMD Passive]  (hidden comment: Cap1)
C49  value 260.4pF  [0805 SMD Passive]  (hidden comment: Cap1)
C50  value 85.88pF  [0805 SMD Passive]  (hidden comment: Cap1)
C51  value 3.54pF  [0805 SMD Passive]  (hidden comment: Cap1)
C52  value 260.4pF  [0805 SMD Passive]  (hidden comment: Cap1)
C53  value 272.3pF  [0805 SMD Passive]  (hidden comment: Cap1)
C54  value 5.67pF  [0805 SMD Passive]  (hidden comment: Cap1)
C55  value 184.8pF  [0805 SMD Passive]  (hidden comment: Cap1)
C57  value 64.3pF  [0805 SMD Passive]  (hidden comment: Cap1)
L11  value 39.78nH  [0805 SMD Passive]  (hidden comment: Inductor)
L12  value 450.5nH  [0805 SMD Passive]  (hidden comment: Inductor)
L13  value 0nH  [0805 SMD Passive]  (hidden comment: Inductor)
L14  value 9.82nH  [0805 SMD Passive]  (hidden comment: Inductor)
L15  value 722.6nH  [0805 SMD Passive]  (hidden comment: Inductor)
L16  value 339.2nH  [0805 SMD Passive]  (hidden comment: Inductor)
L17  value 9.82nH  [0805 SMD Passive]  (hidden comment: Inductor)
L18  value 333.3nH  [0805 SMD Passive]  (hidden comment: Inductor)
L19  value 450.5nH  [0805 SMD Passive]  (hidden comment: Inductor)
L20  value 39.78nH  [0805 SMD Passive]  (hidden comment: Inductor)
R44  value 0  [0805 SMD Passive]  (hidden comment: Resistor)
R45  value 0  [0805 SMD Passive]  (hidden comment: Resistor)
R46  value 0  [0805 SMD Passive]  (hidden comment: Resistor)
R47  value 0  [0805 SMD Passive]  (hidden comment: Resistor)
R48  value 0  [0805 SMD Passive]  (hidden comment: Resistor)
R49  value 0  [0805 SMD Passive]  (hidden comment: Resistor)
R50  value 800  [0805 SMD Passive]  (hidden comment: Resistor)
R1001  value 0  [0805 SMD Passive]  (hidden comment: Resistor)
R1002  value 6.25  [0805 SMD Passive]  (hidden comment: Resistor)
R1003  value 6.25  [0805 SMD Passive]  (hidden comment: Resistor)
SMA_3  SMA1  [SMA Flange]  (value not drawn)

### Ports
DAC_OUT+, DAC_OUT-

### Nets
GND: B2.4 C46.2 C48.1 C49.2 C50.1 C52.2 C53.1 C55.1 C57.2 L11.1 L14.1 L17.1 L20.1 R1001.2 R1002.2 R1003.2
DAC_IOUT_A: B2.1 R50.2 R1002.1 ; port DAC_OUT+
DAC_IOUT_B: B2.3 R50.1 R1003.1 ; port DAC_OUT-
Filter_Input: B2.6 R47.1 R48.1 R49.1
Filter_Output: C45.1 R44.2 R45.2 R46.1
NetB2_2: B2.2 R1001.1
NetC45_2: C45.2 SMA_3.1
NetC46_1: C46.1 C47.1 L11.2 R44.1
NetC47_2: C47.2 L12.1
NetC48_2: C48.2 L13.2 R45.1
NetC49_1: C49.1 C51.1 L12.2 L14.2
NetC50_2: C50.2 L13.1 L16.2
NetC51_2: C51.2 L15.1
NetC52_1: C52.1 C54.1 L15.2 L17.2
NetC53_2: C53.2 L16.1 L18.2
NetC54_2: C54.2 L19.1
NetC55_2: C55.2 L18.1 R48.2
NetC57_1: C57.1 L19.2 L20.2 R49.2
NetR46_2: R46.2 R47.2

Not connected (* = marked no-connect by the designer): B2 5*

### Notes on the sheet
- Band Pass Filtered signal path
- Fstart=90MHz
- Fstop=110MHz
- Mixer Board Interface
- DAC interface
- (near R47) WBC1-1TL  1:1 CoilCraft
- WBC2-1TL  1:2 CoilCraft
- WBC4-1TL  1:4 CoilCraft
- (near R1003) R1002 and R1003 are populated to impedance match the DAC (reduced power)
- Low Pass Filtered signal path
- Fstart=0.3MHz
- Fstop=30MHz
- DAC Filter for signal reconstruction
- v1.0
- Kolos Koblász
- (in symbol Balun3) P; S

### Library data of the parts
B2 = Balun3: as B1 on sheet ADC_board; FootPrint: SMD
C45-C55 C57 = Cap1: as C1 on sheet ADC_board; FootPrint: *
L11-L20 = Ind1: as L1 on sheet ADC_Filter; FootPrint: SMD
R44-R50 R1001-R1003 = Res1: as R1 on sheet ADC_board; FootPrint: SMD
SMA_3 = SMA1: SMA Female; Shape: Straight; Footprint: *; PartNumber: *; Manufacturer: *; OrderCode: *; Mounting: TroughHole

## Sheet MotherBoard_PowerSupply.SchDoc
size A4; DocumentNumber: 6; SheetNumber: 6; SheetTotal: 9
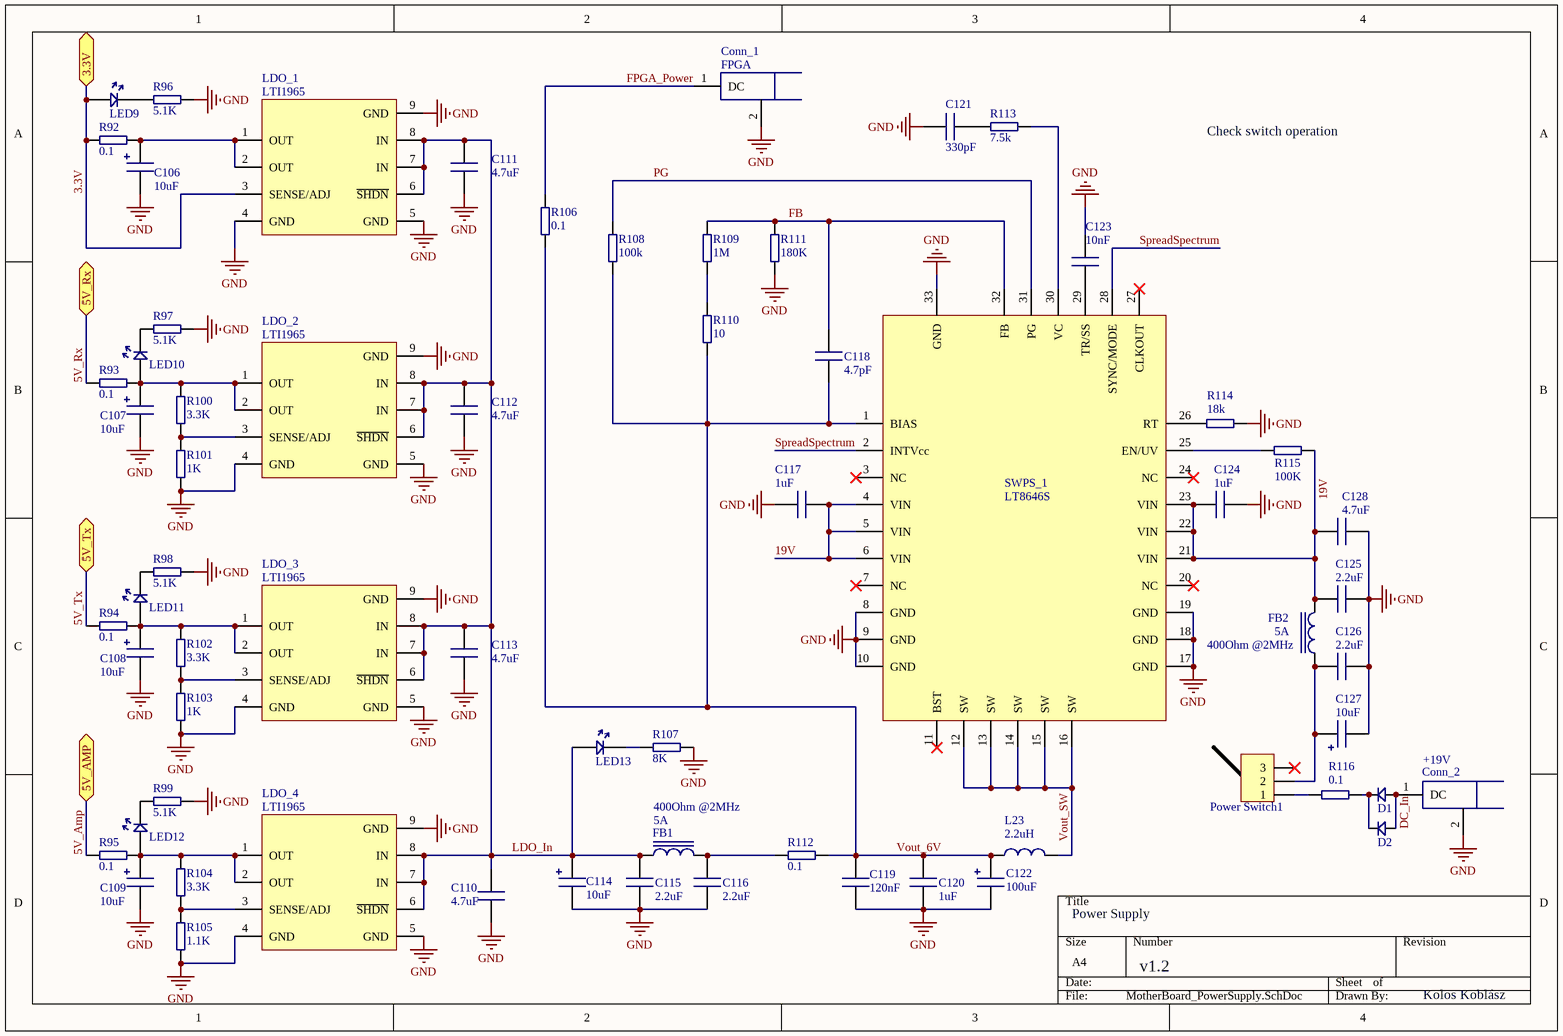
[diagram p5: MotherBoard_PowerSupply.SchDoc]

### Parts
C106  value 10uF  [ELKO_CAP]  (hidden comment: Cap2)
C107  value 10uF  [ELKO_CAP]  (hidden comment: Cap2)
C108  value 10uF  [ELKO_CAP]  (hidden comment: Cap2)
C109  value 10uF  [ELKO_CAP]  (hidden comment: Cap2)
C110  value 4.7uF  [0805 SMD Passive]  (hidden comment: Cap1)
C111  value 4.7uF  [0805 SMD Passive]  (hidden comment: Cap1)
C112  value 4.7uF  [0805 SMD Passive]  (hidden comment: Cap1)
C113  value 4.7uF  [0805 SMD Passive]  (hidden comment: Cap1)
C114  value 10uF  [ELKO_CAP]  (hidden comment: Cap2)
C115  value 2.2uF  [0805 SMD Passive]  (hidden comment: Cap1)
C116  value 2.2uF  [0805 SMD Passive]  (hidden comment: Cap1)
C117  value 1uF  [0805 SMD Passive]  (hidden comment: Cap1)
C118  value 4.7pF  [0805 SMD Passive]  (hidden comment: Cap1)
C119  value 120nF  [0805 SMD Passive]  (hidden comment: Cap1)
C120  value 1uF  [0805 SMD Passive]  (hidden comment: Cap1)
C121  value 330pF  [0805 SMD Passive]  (hidden comment: Cap1)
C122  value 100uF  [ELKO_CAP]  (hidden comment: Cap2)
C123  value 10nF  [0805 SMD Passive]  (hidden comment: Cap1)
C124  value 1uF  [0805 SMD Passive]  (hidden comment: Cap1)
C125  value 2.2uF  [0805 SMD Passive]  (hidden comment: Cap1)
C126  value 2.2uF  [0805 SMD Passive]  (hidden comment: Cap1)
C127  value 10uF  [ELKO_CAP]  (hidden comment: Cap2)
C128  value 4.7uF  [0805 SMD Passive]  (hidden comment: Cap1)
Conn_1  FPGA  [DC_Connector]
Conn_2  +19V  [DC_Connector]
D1  Diode1  [SMB]  (value not drawn)
D2  Diode1  [SMB]  (value not drawn)
FB1  value 400Ohm @2MHz  MaxCurent: 5A  [FerritBead]  (hidden comment: Ferrit Bead)
FB2  value 400Ohm @2MHz  MaxCurent: 5A  [FerritBead]  (hidden comment: Ferrit Bead)
L23  value 2.2uH  [SMD Inductor]  (hidden comment: Inductor)
LDO_1  LTI1965  [LT1965]
LDO_2  LTI1965  [LT1965]
LDO_3  LTI1965  [LT1965]
LDO_4  LTI1965  [LT1965]
LED9  +3.3V  [0805 SMD Passive]  (value not drawn)
LED10  +5V Rx  [0805 SMD Passive]  (value not drawn)
LED11  +5V Tx  [0805 SMD Passive]  (value not drawn)
LED12  +5V AMP  [0805 SMD Passive]  (value not drawn)
LED13  +6V  [0805 SMD Passive]  (value not drawn)
Power_Switch1  Switch  [Switch]  (value not drawn)
R92  value 0.1  [0805 SMD Passive]  (hidden comment: Resistor)
R93  value 0.1  [0805 SMD Passive]  (hidden comment: Resistor)
R94  value 0.1  [0805 SMD Passive]  (hidden comment: Resistor)
R95  value 0.1  [0805 SMD Passive]  (hidden comment: Resistor)
R96  value 5.1K  [0805 SMD Passive]  (hidden comment: Resistor)
R97  value 5.1K  [0805 SMD Passive]  (hidden comment: Resistor)
R98  value 5.1K  [0805 SMD Passive]  (hidden comment: Resistor)
R99  value 5.1K  [0805 SMD Passive]  (hidden comment: Resistor)
R100  value 3.3K  [0805 SMD Passive]  (hidden comment: Resistor)
R101  value 1K  [0805 SMD Passive]  (hidden comment: Resistor)
R102  value 3.3K  [0805 SMD Passive]  (hidden comment: Resistor)
R103  value 1K  [0805 SMD Passive]  (hidden comment: Resistor)
R104  value 3.3K  [0805 SMD Passive]  (hidden comment: Resistor)
R105  value 1.1K  [0805 SMD Passive]  (hidden comment: Resistor)
R106  value 0.1  [0805 SMD Passive]  (hidden comment: Resistor)
R107  value 8K  [0805 SMD Passive]  (hidden comment: Resistor)
R108  value 100k  [0805 SMD Passive]  (hidden comment: Resistor)
R109  value 1M  [0805 SMD Passive]  (hidden comment: Resistor)
R110  value 10  [0805 SMD Passive]  (hidden comment: Resistor)
R111  value 180K  [0805 SMD Passive]  (hidden comment: Resistor)
R112  value 0.1  [0805 SMD Passive]  (hidden comment: Resistor)
R113  value 7.5k  [0805 SMD Passive]  (hidden comment: Resistor)
R114  value 18k  [0805 SMD Passive]  (hidden comment: Resistor)
R115  value 100K  [0805 SMD Passive]  (hidden comment: Resistor)
R116  value 0.1  [0805 SMD Passive]  (hidden comment: Resistor)
SWPS_1  LT8646S  [LT8646S]

### Ports
3.3V, 5V_AMP, 5V_Rx, 5V_Tx

### Nets
GND: C106.2 C107.2 C108.2 C109.2 C110.1 C111.1 C112.1 C113.1 C114.2 C115.1 C116.1 C117.2 C119.2 C120.2 C121.1 C122.2 C123.1 C124.2 C125.1 C126.1 C127.2 C128.1 Conn_1.2(GND) Conn_2.2(GND) LDO_1.4(GND) LDO_1.5(GND) LDO_1.9(GND) LDO_2.4(GND) LDO_2.5(GND) LDO_2.9(GND) LDO_3.4(GND) LDO_3.5(GND) LDO_3.9(GND) LDO_4.4(GND) LDO_4.5(GND) LDO_4.9(GND) R96.2 R97.2 R98.2 R99.2 R101.1 R103.1 R105.1 R107.2 R111.2 R114.2 SWPS_1.8(GND) SWPS_1.9(GND) SWPS_1.10(GND) SWPS_1.17(GND) SWPS_1.18(GND) SWPS_1.19(GND) SWPS_1.33(GND)
3.3V: LDO_1.3(SENSE/ADJ) LED9.2(A) R92.1 ; port 3.3V
5V_Amp: R95.1 ; port 5V_AMP
5V_Rx: R93.1 ; port 5V_Rx
5V_Tx: R94.1 ; port 5V_Tx
19V: C117.1 C124.1 C125.2 C128.2 FB2.1 R115.1 SWPS_1.4(VIN) SWPS_1.5(VIN) SWPS_1.6(VIN) SWPS_1.21(VIN) SWPS_1.22(VIN) SWPS_1.23(VIN)
DC_In: Conn_2.1(DC) D1.2(A) D2.2(A)
FB: C118.1 R109.1 R111.1 SWPS_1.32(FB)
FPGA_Power: Conn_1.1(DC) R106.1
LDO_In: C110.2 C111.2 C112.2 C113.2 C114.1 C115.2 FB1.1 LDO_1.6(~{SHDN}) LDO_1.7(IN) LDO_1.8(IN) LDO_2.6(~{SHDN}) LDO_2.7(IN) LDO_2.8(IN) LDO_3.6(~{SHDN}) LDO_3.7(IN) LDO_3.8(IN) LDO_4.6(~{SHDN}) LDO_4.7(IN) LDO_4.8(IN) LED13.2(A)
PG: R108.1 SWPS_1.31(PG)
SpreadSpectrum: SWPS_1.2(INTVcc) SWPS_1.28(SYNC/MODE)
Vout_6V: C118.2 C119.1 C120.1 C122.1 L23.1 R106.2 R108.2 R110.2 R112.2 SWPS_1.1(BIAS)
Vout_SW: L23.2 SWPS_1.12(SW) SWPS_1.13(SW) SWPS_1.14(SW) SWPS_1.15(SW) SWPS_1.16(SW)
NetC106_1: C106.1 LDO_1.1(OUT) LDO_1.2(OUT) R92.2
NetC107_1: C107.1 LDO_2.1(OUT) LDO_2.2(OUT) LED10.2(A) R93.2 R100.2
NetC108_1: C108.1 LDO_3.1(OUT) LDO_3.2(OUT) LED11.2(A) R94.2 R102.2
NetC109_1: C109.1 LDO_4.1(OUT) LDO_4.2(OUT) LED12.2(A) R95.2 R104.2
NetC116_2: C116.2 FB1.2 R112.1
NetC121_2: C121.2 R113.1
NetC123_2: C123.2 SWPS_1.29(TR/SS)
NetC126_2: C126.2 C127.1 FB2.2 Power_Switch1.2
NetD1_1: D1.1(K) D2.1(K) R116.1
NetLDO_2_3: LDO_2.3(SENSE/ADJ) R100.1 R101.2
NetLDO_3_3: LDO_3.3(SENSE/ADJ) R102.1 R103.2
NetLDO_4_3: LDO_4.3(SENSE/ADJ) R104.1 R105.2
NetLED9_1: LED9.1(K) R96.1
NetLED10_1: LED10.1(K) R97.1
NetLED11_1: LED11.1(K) R98.1
NetLED12_1: LED12.1(K) R99.1
NetLED13_1: LED13.1(K) R107.1
NetPower_Switch1_1: Power_Switch1.1 R116.2
NetR109_2: R109.2 R110.1
NetR113_2: R113.2 SWPS_1.30(VC)
NetR114_1: R114.1 SWPS_1.26(RT)
NetR115_2: R115.2 SWPS_1.25(EN/UV)

Not connected (* = marked no-connect by the designer): Power_Switch1 3*; SWPS_1 3(NC)* 7(NC)* 11(BST)* 20(NC)* 24(NC)* 27(CLKOUT)*

### Notes on the sheet
- Check switch operation
- Power Supply
- v1.2
- Kolos Koblász

### Library data of the parts
C106-C109 C114 C122 C127 = Cap2: SMD Polarized Capacitor; Precision: 20%; MaxVolt: 16V; FootPrint: *
C110-C113 C115-C121 C123-C126 C128 = Cap1: SMD Capacitor; Precision: 5%; MaxVolt: 16V; FootPrint: *
Conn_1 Conn_2 = DC_Connector: Coaxial DC connector - female; Manufacturer: *; Size: *; Vmax: *; Imax: *
D1 = Diode1: Diode; Partnumber: DO-2144AA; MaxForwardCurrent: 100mA; MaxRevVoltage: 2A; Manufacturer: *; Type: *; OrderCode: 83-02-51
D2 = Diode1: Diode; Partnumber: DO-214AA; MaxForwardCurrent: 2A; MaxRevVoltage: 1000V; Manufacturer: *; Type: *; OrderCode: 83-02-51
FB1 FB2 = FerritBead: PartNumber: FB20022-4B-RC; Precision: 10%; FootPrint: THD; Digi Key Order Code: FB20022-4B-RC-ND
L23 = Ind1: SMD Inductor; Manufacturer: Coilcraft; PartNumber: XEL-4030-222; Precision: 20%; MaxCurent: 5A
LDO_1 = LTI1965: Low Dropout Linear Regulator; Manufacturer: Analog Devices; Order Code: LT1965EDD-3.3#PBF; Package Description: 8-Lead Plastic DFN; PartNumber: LTI1965; Version: Fix 3.3V
LDO_2-LDO_4 = LTI1965: Low Dropout Linear Regulator; Manufacturer: Analog Devices; Order Code: LT1965EDD#PBF; Package Description: 8-Lead Plastic DFN; PartNumber: LTI1965; Version: Adjustable
LED9-LED13 = LED_Green: as LED1 on sheet MotherBoard_Interconnect; Footprint: 0805
Power_Switch1 = Switch: 3 state switch; PinNumber: 3; Pitch: 2.54mm; Type: THD 3 state; Digi Key Order Code: EG2355-ND
R92-R116 = Res1: as R1 on sheet ADC_board; FootPrint: SMD
SWPS_1 = LT8646S: Step-Down Silent Switcher Power Supply; Manufacturer: Analog Devices; Order Code: LT8646SEV#PBF; Package Description: LQFN; PartNumber: LT8646S

## Sheet Synthesizer.SchDoc
size A4; DocumentNumber: 7; SheetNumber: 7; SheetTotal: 9
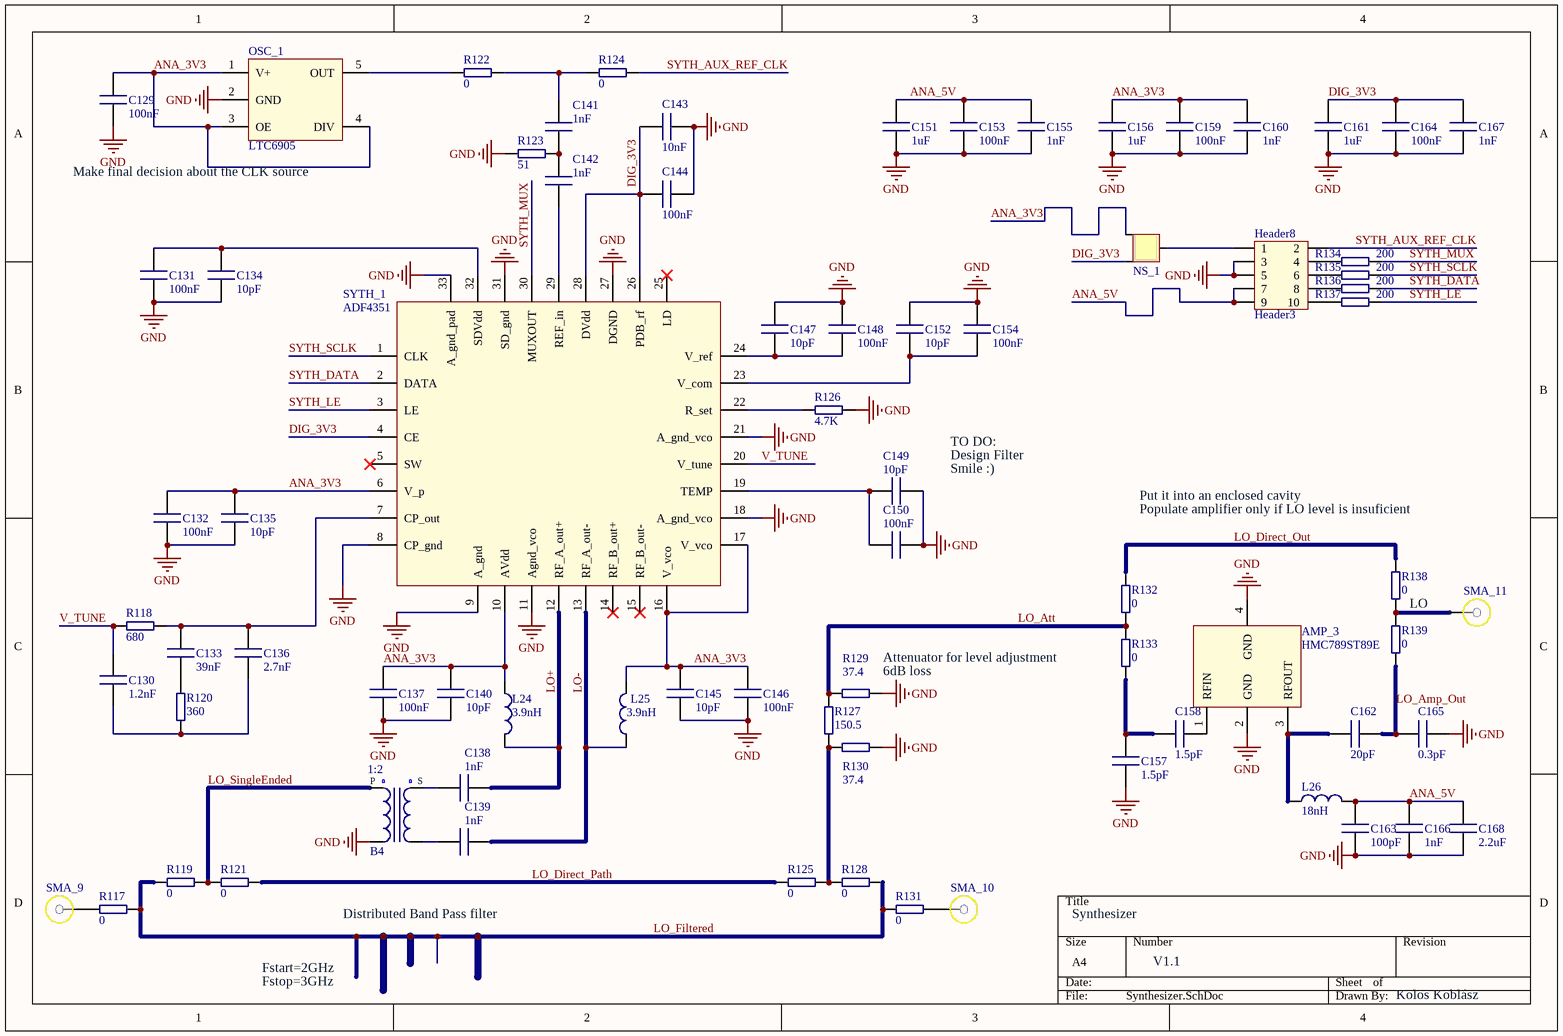
[diagram p6: Synthesizer.SchDoc]

### Parts
AMP_3  HMC789ST89E
B4  ImpedanceTransformation P : S: 1:2  [BALUN_CHIP]  (hidden comment: Balun)
C129  value 100nF  [0805 SMD Passive]  (hidden comment: Cap1)
C130  value 1.2nF  [0805 SMD Passive]  (hidden comment: Cap1)
C131  value 100nF  [0805 SMD Passive]  (hidden comment: Cap1)
C132  value 100nF  [0805 SMD Passive]  (hidden comment: Cap1)
C133  value 39nF  [0805 SMD Passive]  (hidden comment: Cap1)
C134  value 10pF  [0805 SMD Passive]  (hidden comment: Cap1)
C135  value 10pF  [0805 SMD Passive]  (hidden comment: Cap1)
C136  value 2.7nF  [0805 SMD Passive]  (hidden comment: Cap1)
C137  value 100nF  [0805 SMD Passive]  (hidden comment: Cap1)
C138  value 1nF  [0805 SMD Passive]  (hidden comment: Cap1)
C139  value 1nF  [0805 SMD Passive]  (hidden comment: Cap1)
C140  value 10pF  [0805 SMD Passive]  (hidden comment: Cap1)
C141  value 1nF  [0805 SMD Passive]  (hidden comment: Cap1)
C142  value 1nF  [0805 SMD Passive]  (hidden comment: Cap1)
C143  value 10nF  [0805 SMD Passive]  (hidden comment: Cap1)
C144  value 100nF  [0805 SMD Passive]  (hidden comment: Cap1)
C145  value 10pF  [0805 SMD Passive]  (hidden comment: Cap1)
C146  value 100nF  [0805 SMD Passive]  (hidden comment: Cap1)
C147  value 10pF  [0805 SMD Passive]  (hidden comment: Cap1)
C148  value 100nF  [0805 SMD Passive]  (hidden comment: Cap1)
C149  value 10pF  [0805 SMD Passive]  (hidden comment: Cap1)
C150  value 100nF  [0805 SMD Passive]  (hidden comment: Cap1)
C151  value 1uF  [0805 SMD Passive]  (hidden comment: Cap1)
C152  value 10pF  [0805 SMD Passive]  (hidden comment: Cap1)
C153  value 100nF  [0805 SMD Passive]  (hidden comment: Cap1)
C154  value 100nF  [0805 SMD Passive]  (hidden comment: Cap1)
C155  value 1nF  [0805 SMD Passive]  (hidden comment: Cap1)
C156  value 1uF  [0805 SMD Passive]  (hidden comment: Cap1)
C157  value 1.5pF  [0805 SMD Passive]  (hidden comment: Cap1)
C158  value 1.5pF  [0805 SMD Passive]  (hidden comment: Cap1)
C159  value 100nF  [0805 SMD Passive]  (hidden comment: Cap1)
C160  value 1nF  [0805 SMD Passive]  (hidden comment: Cap1)
C161  value 1uF  [0805 SMD Passive]  (hidden comment: Cap1)
C162  value 20pF  [0805 SMD Passive]  (hidden comment: Cap1)
C163  value 100pF  [0805 SMD Passive]  (hidden comment: Cap1)
C164  value 100nF  [0805 SMD Passive]  (hidden comment: Cap1)
C165  value 0.3pF  [0805 SMD Passive]  (hidden comment: Cap1)
C166  value 1nF  [0805 SMD Passive]  (hidden comment: Cap1)
C167  value 1nF  [0805 SMD Passive]  (hidden comment: Cap1)
C168  value 2.2uF  [0805 SMD Passive]  (hidden comment: Cap1)
Header8  Header3  [Header3]
L24  value 3.9nH  [0805 SMD Passive]  (hidden comment: Inductor)
L25  value 3.9nH  [0805 SMD Passive]  (hidden comment: Inductor)
L26  value 18nH  [0805 SMD Passive]  (hidden comment: Inductor)
NS_1  NetSplit  [NetSplit_2]  (value not drawn)
OSC_1  LTC6905
R117  value 0  [0805 SMD Passive]  (hidden comment: Resistor)
R118  value 680  [0805 SMD Passive]  (hidden comment: Resistor)
R119  value 0  [0805 SMD Passive]  (hidden comment: Resistor)
R120  value 360  [0805 SMD Passive]  (hidden comment: Resistor)
R121  value 0  [0805 SMD Passive]  (hidden comment: Resistor)
R122  value 0  [0805 SMD Passive]  (hidden comment: Resistor)
R123  value 51  [0805 SMD Passive]  (hidden comment: Resistor)
R124  value 0  [0805 SMD Passive]  (hidden comment: Resistor)
R125  value 0  [0805 SMD Passive]  (hidden comment: Resistor)
R126  value 4.7K  [0805 SMD Passive]  (hidden comment: Resistor)
R127  value 150.5  [0805 SMD Passive]  (hidden comment: Resistor)
R128  value 0  [0805 SMD Passive]  (hidden comment: Resistor)
R129  value 37.4  [0805 SMD Passive]  (hidden comment: Resistor)
R130  value 37.4  [0805 SMD Passive]  (hidden comment: Resistor)
R131  value 0  [0805 SMD Passive]  (hidden comment: Resistor)
R132  value 0  [0805 SMD Passive]  (hidden comment: Resistor)
R133  value 0  [0805 SMD Passive]  (hidden comment: Resistor)
R134  value 200  [0805 SMD Passive]  (hidden comment: Resistor)
R135  value 200  [0805 SMD Passive]  (hidden comment: Resistor)
R136  value 200  [0805 SMD Passive]  (hidden comment: Resistor)
R137  value 200  [0805 SMD Passive]  (hidden comment: Resistor)
R138  value 0  [0805 SMD Passive]  (hidden comment: Resistor)
R139  value 0  [0805 SMD Passive]  (hidden comment: Resistor)
SMA_9  SMA1  [SMA Flange]  (value not drawn)
SMA_10  SMA1  [SMA Flange]  (value not drawn)
SMA_11  SMA1  [SMA Flange]  (value not drawn)
SYTH_1  ADF4351  [LFCSP-32]

### Nets
GND: AMP_3.2(GND) AMP_3.4(GND) B4.4 C129.2 C131.2 C132.2 C134.2 C135.2 C137.2 C140.2 C143.2 C144.2 C145.2 C146.2 C147.2 C148.2 C149.2 C150.2 C151.1 C152.2 C153.1 C154.2 C155.1 C156.1 C157.1 C159.1 C160.1 C161.1 C163.2 C164.1 C165.2 C166.2 C167.1 C168.2 Header8.3 Header8.5 OSC_1.2(GND) R123.1 R126.2 R129.2 R130.2 SYTH_1.8(CP_gnd) SYTH_1.9(A_gnd) SYTH_1.11(Agnd_vco) SYTH_1.18(A_gnd_vco) SYTH_1.21(A_gnd_vco) SYTH_1.27(DGND) SYTH_1.31(SD_gnd) SYTH_1.33(A_gnd_pad)
ANA_3V3: C129.1 C132.1 C135.1 C137.1 C140.1 C145.1 C146.1 C156.2 C159.2 C160.2 L24.1 L25.2 NS_1.0 OSC_1.1(V+) OSC_1.3(OE) OSC_1.4(DIV) SYTH_1.6(V_p) SYTH_1.10(AVdd) SYTH_1.16(V_vco) SYTH_1.17(V_vco)
ANA_5V: C151.2 C153.2 C155.2 C163.1 C166.1 C168.1 Header8.7 Header8.9 L26.2
DIG_3V3: C143.1 C144.1 C161.2 C164.2 C167.2 NS_1.0 SYTH_1.4(CE) SYTH_1.26(PDB_rf) SYTH_1.28(DVdd)
LO+: C138.2 L24.2 SYTH_1.12(RF_A_out+)
LO-: C139.2 L25.1 SYTH_1.13(RF_A_out-)
LO_Amp_Out: C162.2 C165.1 R139.1
LO_Att: R127.1 R129.1 R132.1 R133.2
LO_Direct_Out: R132.2 R138.2
LO_Direct_Path: R121.2 R125.1
LO_Filtered: R117.2 R119.1 R128.2 R131.1
LO_SingleEnded: B4.2 R119.2 R121.1
SYTH_AUX_REF_CLK: Header8.2 R124.2
SYTH_DATA: R136.1 SYTH_1.2(DATA)
SYTH_LE: R137.1 SYTH_1.3(LE)
SYTH_MUX: R134.1 SYTH_1.30(MUXOUT)
SYTH_SCLK: R135.1 SYTH_1.1(CLK)
V_TUNE: C130.1 R118.2 SYTH_1.20(V_tune)
NetAMP_3_1: AMP_3.1(RFIN) C158.2
NetAMP_3_3: AMP_3.3(RFOUT) C162.1 L26.1
NetB4_1: B4.1 C138.1
NetB4_3: B4.3 C139.1
NetC130_2: C130.2 C136.2 R120.1
NetC131_1: C131.1 C134.1 SYTH_1.32(SDVdd)
NetC133_1: C133.1 C136.1 R118.1 SYTH_1.7(CP_out)
NetC133_2: C133.2 R120.2
NetC141_1: C141.1 R122.2 R124.1
NetC141_2: C141.2 C142.1 R123.2
NetC142_2: C142.2 SYTH_1.29(REF_in)
NetC147_1: C147.1 C148.1 SYTH_1.24(V_ref)
NetC149_1: C149.1 C150.1 SYTH_1.19(TEMP)
NetC152_1: C152.1 C154.1 SYTH_1.23(V_com)
NetC157_2: C157.2 C158.1 R133.1
NetHeader8_1: Header8.1 NS_1.0
NetHeader8_4: Header8.4 R134.2
NetHeader8_6: Header8.6 R135.2
NetHeader8_8: Header8.8 R136.2
NetHeader8_10: Header8.10 R137.2
NetOSC_1_5: OSC_1.5(OUT) R122.1
NetR117_1: R117.1 SMA_9.1
NetR125_2: R125.2 R127.2 R128.1 R130.1
NetR126_1: R126.1 SYTH_1.22(R_set)
NetR131_2: R131.2 SMA_10.1
NetR138_1: R138.1 R139.2 SMA_11.1

Not connected (* = marked no-connect by the designer): SYTH_1 5(SW)* 14(RF_B_out+)* 15(RF_B_out-)* 25(LD)*

### Notes on the sheet
- Make final decision about the CLK source
- TO DO:
- Design Filter
- (near C149) Smile :)
- Populate amplifier only if LO level is insuficient
- Put it into an enclosed cavity
- LO
- Attenuator for level adjustment
- (near R129) 6dB loss
- Distributed Band Pass filter
- Synthesizer
- Fstart=2GHz
- Fstop=3GHz
- V1.1
- Kolos Koblász
- (in symbol Balun4) P; S

### Library data of the parts
AMP_3 = HMC789ST89E: Gain Block MMIC; Manufacturer: Analog Devices; Package Description: SOT89; Order Code: HMC789ST89E; PartNumber: HMC789ST89E
B4 = Balun4: SMD Balun; Manufacturer: TDK; PartNumber: HHM1918A2; MaxFrequency: 2700MHz; MinFrequency: 2300MHz; FootPrint: SMD
C129-C168 = Cap1: as C1 on sheet ADC_board; FootPrint: *
Header8 = Header3: 10 pin DIL header; PinNumber: 10; Row: 2; Pitch: 2.54mm; Type: Straight
L24-L26 = Ind1: as L1 on sheet ADC_Filter; FootPrint: SMD
NS_1 = NetSplit: Net Split 2 to 1
OSC_1 = LTC6905: Fixed frequency oscillator; Manufacturer: Analog Devices; Order Code: LTC6905-100; Package Description: 5-Lead Plastic TSOT-23; PartNumber: LTC6905-100
R117-R139 = Res1: as R1 on sheet ADC_board; FootPrint: SMD
SMA_9-SMA_11 = SMA1: SMA Female; Shape: 90°; Footprint: *; PartNumber: *; Manufacturer: *; OrderCode: *; Mounting: TroughHole
SYTH_1 = ADF4351: Sythesizer with integrated VCO; Manufacturer: Analog Devices; Order Code: ADF4351-BCPZ; Package Description: 32-Lead Lead Frame Chip Scale Package; PartNumber: ADF4351